# Altium schematic sheet iDProx.SchDoc
size A3
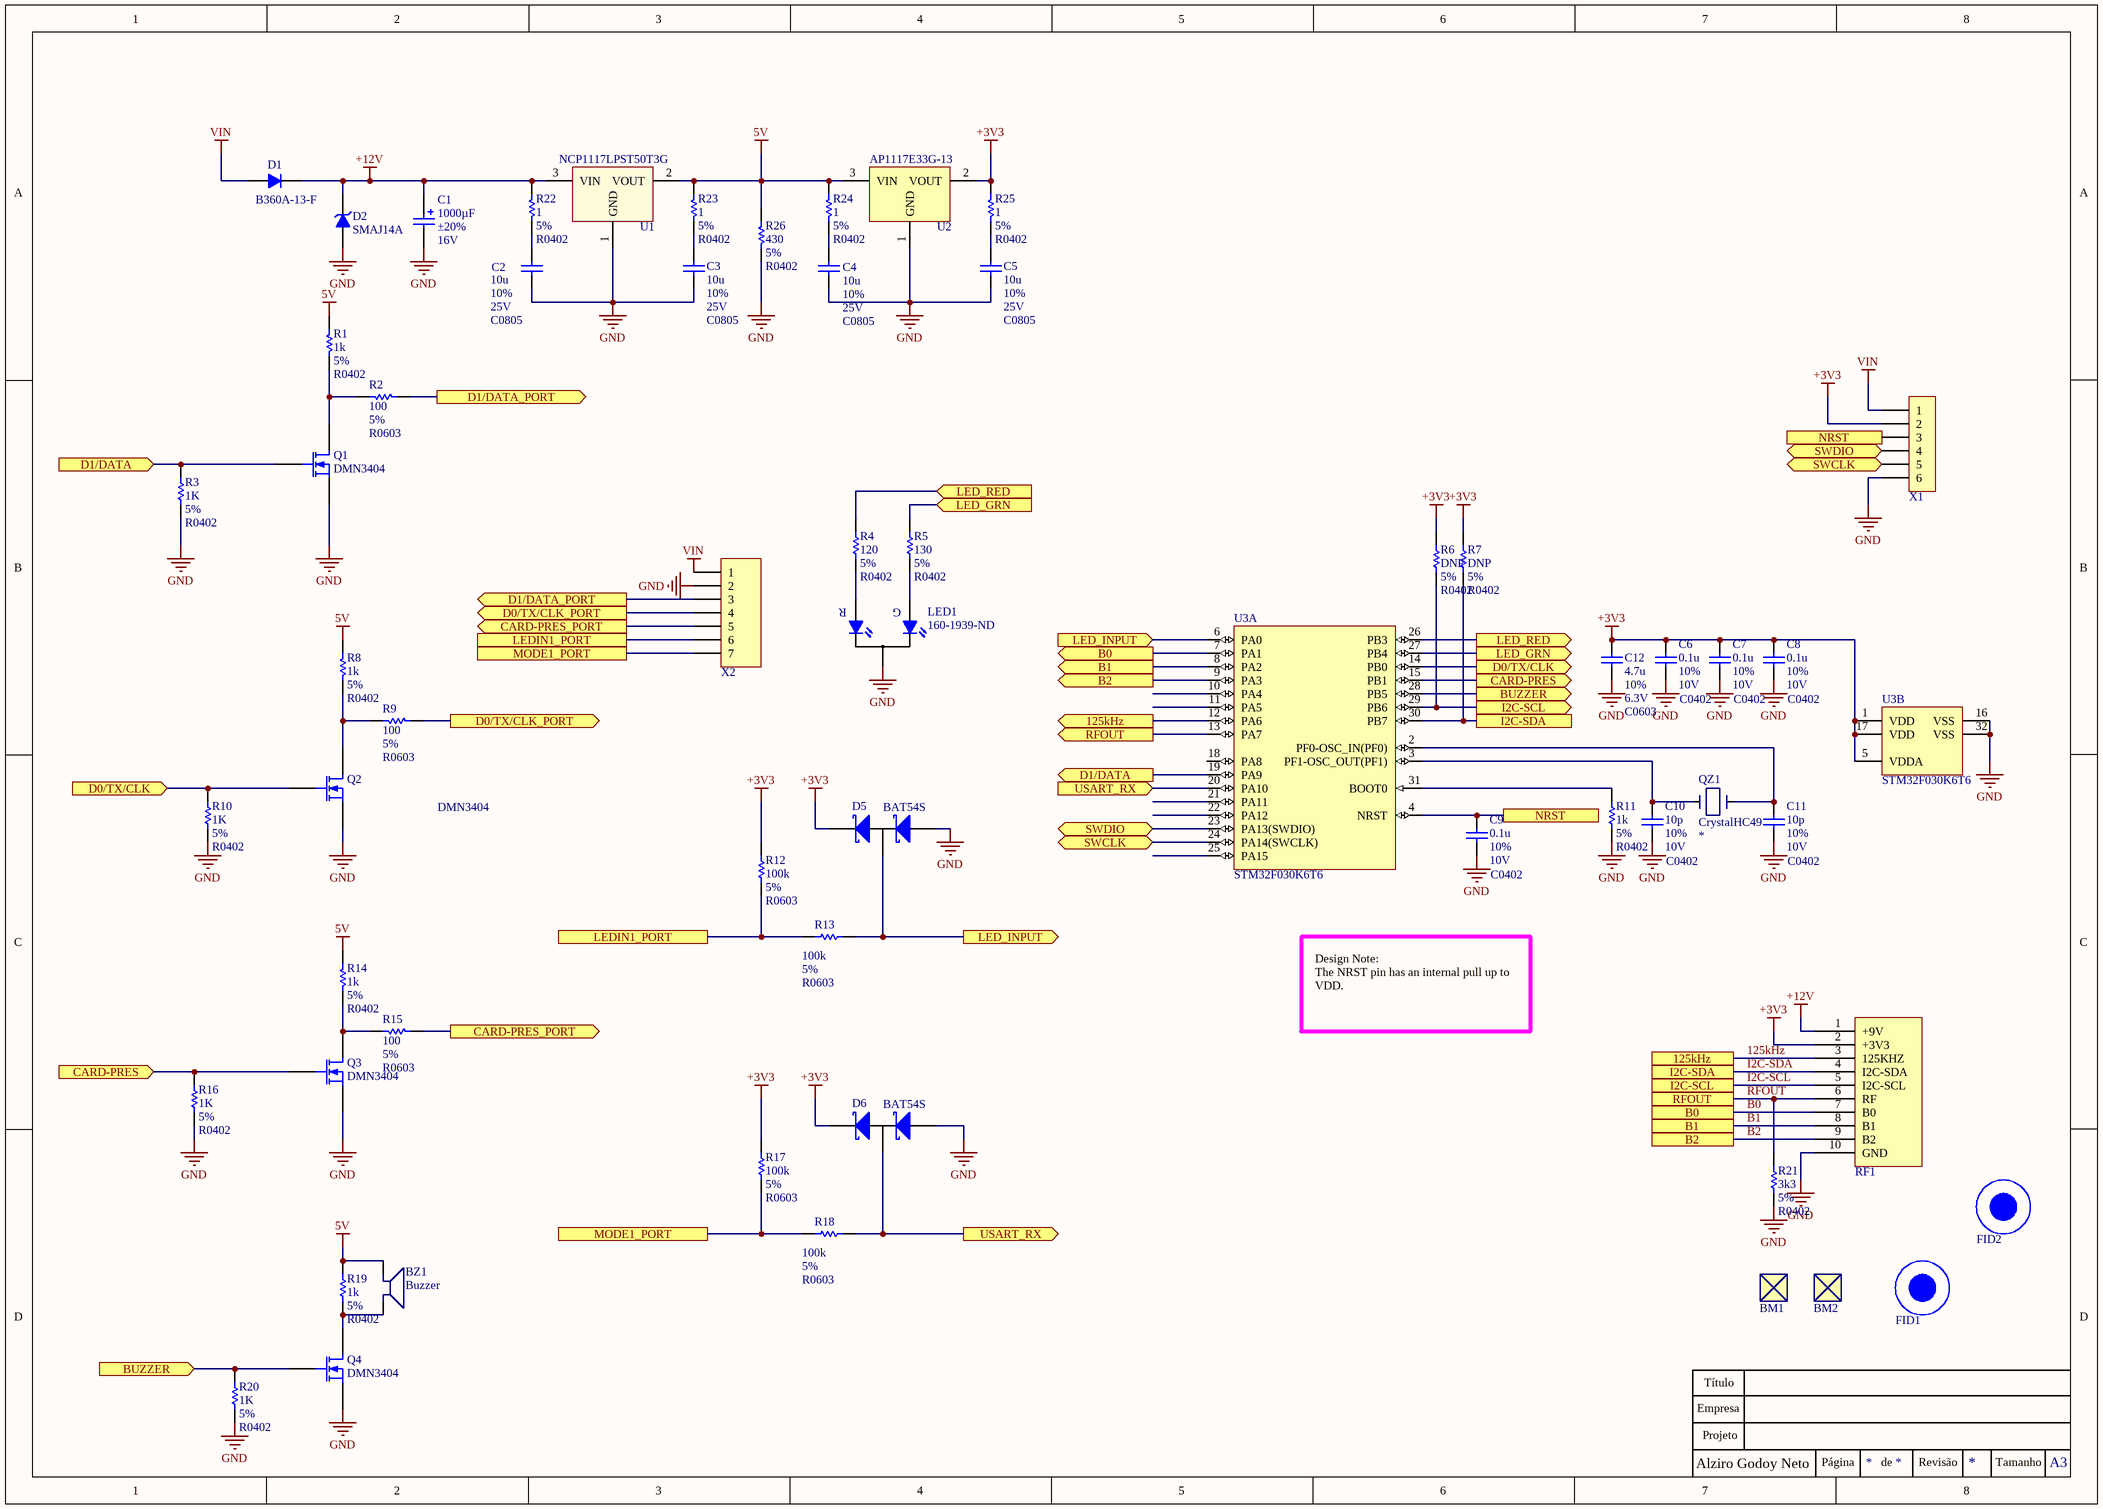
[diagram p0: iDProx.SchDoc]

## Parts
BM1  BADMARK  [BADMARK]  (value not drawn)
BM2  BADMARK  [BADMARK]  (value not drawn)
BZ1  Buzzer  [Buzzer]
C1  Capacitance: 1000µF  Tolerance: ±20%  Voltage Rating: 16V  [ESK108M016AH2AA]  (hidden comment: ESK108M016AH2AA)
C2  value 10u  Tolerance: 10%  MAX VDC: 25V  [C0805]  (hidden comment: Cap0805)
C3  value 10u  Tolerance: 10%  MAX VDC: 25V  [C0805]  (hidden comment: Cap0805)
C4  value 10u  Tolerance: 10%  MAX VDC: 25V  [C0805]  (hidden comment: Cap0805)
C5  value 10u  Tolerance: 10%  MAX VDC: 25V  [C0805]  (hidden comment: Cap0805)
C6  value 0.1u  Tolerance: 10%  MAX VDC: 10V  [C0402]  (hidden comment: Cap0402)
C7  value 0.1u  Tolerance: 10%  MAX VDC: 10V  [C0402]  (hidden comment: Cap0402)
C8  value 0.1u  Tolerance: 10%  MAX VDC: 10V  [C0402]  (hidden comment: Cap0402)
C9  value 0.1u  Tolerance: 10%  MAX VDC: 10V  [C0402]  (hidden comment: Cap0402)
C10  value 10p  Tolerance: 10%  MAX VDC: 10V  [C0402]  (hidden comment: Cap0402)
C11  value 10p  Tolerance: 10%  MAX VDC: 10V  [C0402]  (hidden comment: Cap0402)
C12  value 4.7u  Tolerance: 10%  MAX VDC: 6.3V  [C0603]  (hidden comment: Cap0603)
D1  B360A-13-F  [SMA]
D2  SMAJ14A  [SMA]
D5  BAT54S  [SOT23-3]
D6  BAT54S  [SOT23-3]
FID1  FIDUCIAL  [FIDUCIAL-1p5X3]  (value not drawn)
FID2  FIDUCIAL  [FIDUCIAL-1p5X3]  (value not drawn)
LED1  Supplier Part Number 1: 160-1939-ND  [LTL1BEKVJNN]  (hidden comment: LTL1BEKVJNN)
Q1  DMN3404  [SOT23-3]
Q2  DMN3404  [SOT23-3]
Q3  DMN3404  [SOT23-3]
Q4  DMN3404  [SOT23-3]
QZ1  CrystalHC49  [HC49]
R1  value 1k  Tolerance: 5%  [R0402]  (hidden comment: Res0402)
R2  value 100  Tolerance: 5%  [R0603]  (hidden comment: Res0603)
R3  value 1K  Tolerance: 5%  [R0402]  (hidden comment: Res0402)
R4  value 120  Tolerance: 5%  [R0402]  (hidden comment: Res0402)
R5  value 130  Tolerance: 5%  [R0402]  (hidden comment: Res0402)
R6  value DNP  Tolerance: 5%  [R0402]  (hidden comment: Res0402)
R7  value DNP  Tolerance: 5%  [R0402]  (hidden comment: Res0402)
R8  value 1k  Tolerance: 5%  [R0402]  (hidden comment: Res0402)
R9  value 100  Tolerance: 5%  [R0603]  (hidden comment: Res0603)
R10  value 1K  Tolerance: 5%  [R0402]  (hidden comment: Res0402)
R11  value 1k  Tolerance: 5%  [R0402]  (hidden comment: Res0402)
R12  value 100k  Tolerance: 5%  [R0603]  (hidden comment: Res0603)
R13  value 100k  Tolerance: 5%  [R0603]  (hidden comment: Res0603)
R14  value 1k  Tolerance: 5%  [R0402]  (hidden comment: Res0402)
R15  value 100  Tolerance: 5%  [R0603]  (hidden comment: Res0603)
R16  value 1K  Tolerance: 5%  [R0402]  (hidden comment: Res0402)
R17  value 100k  Tolerance: 5%  [R0603]  (hidden comment: Res0603)
R18  value 100k  Tolerance: 5%  [R0603]  (hidden comment: Res0603)
R19  value 1k  Tolerance: 5%  [R0402]  (hidden comment: Res0402)
R20  value 1K  Tolerance: 5%  [R0402]  (hidden comment: Res0402)
R21  value 3k3  Tolerance: 5%  [R0402]  (hidden comment: Res0402)
R22  value 1  Tolerance: 5%  [R0402]  (hidden comment: Res0402)
R23  value 1  Tolerance: 5%  [R0402]  (hidden comment: Res0402)
R24  value 1  Tolerance: 5%  [R0402]  (hidden comment: Res0402)
R25  value 1  Tolerance: 5%  [R0402]  (hidden comment: Res0402)
R26  value 430  Tolerance: 5%  [R0402]  (hidden comment: Res0402)
RF1  REPASK/REPMIF  [REPASK_REPMIF]  (value not drawn)
U1  NCP1117LPST50T3G  [SOT223]
U2  AP1117E33G-13  [SOT223]
U3  STM32F030K6T6  [STM-LQFP32_N]  (parts A,B of 2)
X1  Header 6  [1X06]  (value not drawn)
X2  JST7_HORIZ  [JST7_HORIZ]  (value not drawn)

## Ports
125kHz, 125kHz (out), B0, B0 (out), B1, B1 (out), B2, B2 (out), BUZZER (in), BUZZER (out), CARD-PRES (in), CARD-PRES (out), CARD-PRES_PORT (out), D0/TX/CLK (in), D0/TX/CLK (out), D0/TX/CLK_PORT (out), D1/DATA (in), D1/DATA (out), D1/DATA_PORT (out), I2C-SCL, I2C-SCL (out), I2C-SDA, LED_GRN (in), LED_GRN (out), LED_INPUT (in), LED_INPUT (out), LED_RED (in), LED_RED (out), LEDIN1_PORT, MODE1_PORT, NRST, RFOUT, RFOUT (out), SWCLK (bidir), SWDIO (bidir), USART_RX (in), USART_RX (out)

## Nets
5V: BZ1.1 R1.2 R8.2 R14.2 R19.2 R23.2 R24.2 R26.2 U1.2(VOUT) U2.3(VIN)
+3V3: C6.2 C7.2 C8.2 C12.2 D5.3(A1) D6.3(A1) R6.2 R7.2 R12.2 R17.2 R25.2 RF1.2(+3V3) U2.2(VOUT) U3.1(VDD) U3.5(VDDA) U3.17(VDD) X1.2
+12V: C1.1 D1.2(K) D2.2(K) R22.2 RF1.1(+9V) U1.3(VIN)
GND: C1.2 C2.2 C3.1 C4.2 C5.1 C6.1 C7.1 C8.1 C9.1 C10.1 C11.1 C12.1 D2.1(A) D5.2(A2) D6.2(A2) LED1.2(K) Q1.3(S) Q2.3(S) Q3.3(S) Q4.3(S) R3.1 R10.1 R11.1 R16.1 R20.1 R21.1 R26.1 RF1.10(GND) U1.1(GND) U2.1(GND) U3.16(VSS) U3.32(VSS) X1.6 X2.2
VIN: D1.1(A) X1.1 X2.1
125kHz: RF1.3(125KHZ) U3.12(PA6) ; port 125kHz
B0: RF1.7(B0) U3.7(PA1) ; port B0
B1: RF1.8(B1) U3.8(PA2) ; port B1
B2: RF1.9(B2) U3.9(PA3) ; port B2
BUZZER: Q4.2(G) R20.2 U3.28(PB5) ; port BUZZER
CARD-PRES: Q3.2(G) R16.2 U3.15(PB1) ; port CARD-PRES
CARD-PRES_PORT: R15.1 X2.5 ; port CARD-PRES_PORT
D0/TX/CLK: Q2.2(G) R10.2 U3.14(PB0) ; port D0/TX/CLK
D0/TX/CLK_PORT: R9.1 X2.4 ; port D0/TX/CLK_PORT
D1/DATA: Q1.2(G) R3.2 U3.19(PA9) ; port D1/DATA
D1/DATA_PORT: R2.1 X2.3 ; port D1/DATA_PORT
I2C-SCL: R6.1 RF1.5(I2C-SCL) U3.29(PB6) ; port I2C-SCL
I2C-SDA: R7.1 RF1.4(I2C-SDA) U3.30(PB7) ; port I2C-SDA
LED_GRN: R5.2 U3.27(PB4) ; port LED_GRN
LED_INPUT: D5.1(K) R13.2 U3.6(PA0) ; port LED_INPUT
LED_RED: R4.2 U3.26(PB3) ; port LED_RED
LEDIN1_PORT: R12.1 R13.1 X2.6 ; port LEDIN1_PORT
MODE1_PORT: R17.1 R18.1 X2.7 ; port MODE1_PORT
NRST: C9.2 U3.4(NRST) X1.3 ; port NRST
RFOUT: R21.2 RF1.6(RF) U3.13(PA7) ; port RFOUT
SWCLK: U3.24(PA14(SWCLK)) X1.5 ; port SWCLK
SWDIO: U3.23(PA13(SWDIO)) X1.4 ; port SWDIO
USART_RX: D6.1(K) R18.2 U3.20(PA10) ; port USART_RX
NetBZ1_2: BZ1.2 Q4.1(D) R19.1
NetC2_1: C2.1 R22.1
NetC3_2: C3.2 R23.1
NetC4_1: C4.1 R24.1
NetC5_2: C5.2 R25.1
NetC10_2: C10.2 QZ1.2(X2) U3.3(PF1-OSC_OUT(PF1))
NetC11_2: C11.2 QZ1.1(X1) U3.2(PF0-OSC_IN(PF0))
NetLED1_1: LED1.1(AR) R4.1
NetLED1_3: LED1.3(AG) R5.1
NetQ1_1: Q1.1(D) R1.1 R2.2
NetQ2_1: Q2.1(D) R8.1 R9.2
NetQ3_1: Q3.1(D) R14.1 R15.2
NetR11_2: R11.2 U3.31(BOOT0)

Not connected (* = marked no-connect by the designer): U3 10(PA4) 11(PA5) 18(PA8) 21(PA11) 22(PA12) 25(PA15)

## Notes on the sheet
- Design Note:
  The NRST pin has an internal pull up to VDD.
- Título
- Empresa
- Projeto
- Alziro Godoy Neto
- Página
- de
- Revisão
- Tamanho
- A3
- (in symbol LTL1BEKVJNN) R; G

## Library data of the parts
BM1 BM2 = BADMARK: Bad Mark Indicator
BZ1 = Buzzer: Standard PTH Buzzer
C1 = ESK108M016AH2AA: CAP ALUM 1000UF 20% 16V RADIAL; Manufacturer: Kemet; Lifetime @ Temp.: 2000 Hrs @ 85°C; Polarization: Polar; Ripple Current: 630mA @ 120Hz; Supplier 1: Digi-Key; Manufacturer Part Number: ESK108M016AH2AA; RoHS: RoHS Compliant; Category: Capacitors; Stock 1: 2866; Pricing 1: 1=0.43, 10=0.298, 50=0.2086, 100=0.1788, 250=0.149, 500=0.1341, 1000=0.11324, 2500=0.10728, 5000=0.10132 (USD); Packaging: Bulk; ESR (Equivalent Series Resistance): -; Operating Temperature: -40°C ~ 85°C; Applications: General Purpose; Impedance: -; Lead Spacing: 0.197" (5.00mm); Size / Dimension: 0.394" Dia (10.00mm); Height - Seated (Max): 0.669" (17.00mm); Surface Mount Land Size: -; Mounting Type: Through Hole; Package / Case: Radial, Can; ComponentLink1URL: http://capacitoredge.kemet.com/capedge2/DataSheet?pn=ESK108M016AH2AA; ComponentLink1Description: http://capacitoredge.kemet.com/capedge2/DataSheet?pn=ESK108M016AH2AA; Supplier Part Number 1: 399-6106-ND
C2-C5 = Cap0805: Capacitor
C6-C11 = Cap0402: Capacitor
C12 = Cap0603: Capacitor
D1 = B360A: B360A Diode; Manufacturer: Diodes Incorporated; Diode Type: Schottky; Voltage - DC Reverse (Vr) (Max): 60V; Current - Average Rectified (Io): 3A; Voltage - Forward (Vf) (Max) @ If: 700mV @ 3A; Speed: Fast Recovery =< 500ns, > 200mA (Io); Current - Reverse Leakage @ Vr: 500µA @ 60V; Capacitance @ Vr, F: 200pF @ 4V, 1MHz; Supplier 1: Digi-Key; Supplier Part Number 1: B360A-FDICT-ND; Manufacturer Part Number: B360A-13-F; RoHS: RoHS Compliant; Category: Discrete Semiconductor Products; Stock 1: 132804; Pricing 1: 1=0.5, 10=0.394, 25=0.3324, 100=0.2708, 250=0.22424, 500=0.18526, 1000=0.13875, 2500=0.1275 (USD); Packaging: Cut Tape (CT); Reverse Recovery Time (trr): -; Mounting Type: Surface Mount; Package / Case: DO-214AC, SMA; Supplier Device Package: SMA; Operating Temperature - Junction: -55°C ~ 150°C; ComponentLink1URL: http://www.diodes.com/_files/datasheets/ds30891.pdf; ComponentLink1Description: http://www.diodes.com/_files/datasheets/ds30891.pdf
D2 = SMAJ14A: TVS DIODE 14VWM 23.2VC SMA; Manufacturer: Littelfuse Inc.; Type: Zener; Unidirectional Channels: 1; Voltage - Reverse Standoff (Typ): 14V; Voltage - Breakdown (Min): 15.6V; Voltage - Clamping (Max) @ Ipp: 23.2V; Current - Peak Pulse (10/1000µs): 17.2A; Power - Peak Pulse: 400W; Power Line Protection: No; Supplier 1: Digi-Key; Manufacturer Part Number: SMAJ14A; RoHS: RoHS Compliant; Category: Circuit Protection; Stock 1: 42648; Pricing 1: 1=0.43, 10=0.36, 25=0.3156, 100=0.2701, 250=0.23424, 500=0.1984, 1000=0.15295, 2500=0.13984 (USD); Packaging: Cut Tape (CT); Bidirectional Channels: -; Applications: General Purpose; Capacitance @ Frequency: -; Operating Temperature: -55°C ~ 150°C (TJ); Mounting Type: Surface Mount; Package / Case: DO-214AC, SMA; Supplier Device Package: DO-214AC (SMA); ComponentLink1URL: http://www.littelfuse.com/~/media/electronics/datasheets/tvs_diodes/littelfuse_tvs_diode_smaj_datasheet.pdf.pdf; ComponentLink1Description: http://www.littelfuse.com/~/media/electronics/datasheets/tvs_diodes/littelfuse_tvs_diode_smaj_datasheet.pdf.pdf; Supplier Part Number 1: SMAJ14ALFCT-ND
D5 D6 = BAT54S: DIODE ARRAY SCHOTTKY 30V SOT23
FID1 FID2 = FIDUCIAL: Standard fiducial for Control iD boards
LED1 = LTL1BEKVJNN: LED GRN/RED DIFF 3MM ROUND T/H; Manufacturer: Lite-On Inc.; Color: Green, Red; Lens Color: White; Lens Transparency: Diffused; Millicandela Rating: 110mcd Green, 110mcd Red; Lens Style/Size: Round with Domed Top, 3.00mm; Voltage - Forward (Vf) (Typ): 2.1V Green, 2V Red; Current - Test: 20mA Green, 20mA Red; Viewing Angle: 45°; Wavelength - Dominant: 572nm Green, 631nm Red; Wavelength - Peak: 575nm Green, 639nm Red; Supplier 1: Digi-Key; Manufacturer Part Number: LTL1BEKVJNN; RoHS: RoHS Compliant; Category: Optoelectronics; Stock 1: 19364; Pricing 1: 1=0.47, 10=0.332, 100=0.2216, 250=0.18004, 500=0.13296, 1000=0.1108, 2500=0.09972, 5000=0.09418, 10000=0.08587 (USD); Packaging: Bulk; Mounting Type: Through Hole; Features: -; Package / Case: Radial - 3 Leads; Supplier Device Package: -; Size / Dimension: -; Height (Max): 5.15mm; ComponentLink1URL: http://optoelectronics.liteon.com/upload/download/DS20-2001-645/S_110_LTL1BEKVJNN.pdf; ComponentLink1Description: http://optoelectronics.liteon.com/upload/download/DS20-2001-645/S_110_LTL1BEKVJNN.pdf
Q1-Q4 = DMN3404: DMN3404 N-Channel MOSFET; Supplier 1: Digi-Key; Supplier Part Number 1: DMN3404LDICT-ND
R1 R3-R8 R10 R11 R14 R16 R19-R26 = Res0402: Resistor
R2 R9 R12 R13 R15 R17 R18 = Res0603: Resistor
RF1 = REPASK/REPMIF: Control iD RF Module
U1 = NCP1117LPST50T3G: IC REG LDO 5V 1A SOT223; Manufacturer: ON Semiconductor; Regulator Topology: Positive Fixed; Voltage - Dropout (Typical): 1.3V @ 1A; Number of Regulators: 1; Voltage - Input: Up to 18V; Current - Limit (Min): 1.1A; Supplier 1: Digi-Key; Manufacturer Part Number: NCP1117LPST50T3G; RoHS: RoHS Compliant; Category: Integrated Circuits (ICs); Stock 1: 6004; Pricing 1: 1=0.45, 10=0.362, 100=0.2468, 500=0.18476, 1000=0.13838 (USD); Packaging: Cut Tape (CT); Voltage - Output: 5V; Current - Output: 1A; Operating Temperature: 0°C ~ 125°C; Mounting Type: Surface Mount; Package / Case: TO-261-4, TO-261AA; Supplier Device Package: SOT-223; ComponentLink1URL: http://www.onsemi.com/pub_link/Collateral/NCP1117LP-D.PDF; ComponentLink1Description: http://www.onsemi.com/pub_link/Collateral/NCP1117LP-D.PDF; Supplier Part Number 1: NCP1117LPST50T3GOSCT-ND
U3 = STM32F030K6T6: ARM Cortex-M0 32-bit MCU, 32 KB Flash, 4 KB Internal RAM, 26 I/Os, 32-pin LQFP, -40 to 85 degC, Tray; FLASH Size (Prog) (kB): 32; I/Os (High Current): 26; Internal RAM Size (kB): 4; Operating Frequency(F) (Processor speed) (MHz): 48; Supply Voltage(Vcc) min (V): 2.4; DatasheetVersion: Rev. 1; PackageVersion: Rev. 1, 07/2013; PackageReference: LQFP32; PackageDescription: 32-Pin Low Profile Quad Flat Package, 7 x 7 mm Body, 0.8 mm Pitch; Supplier 1: Digi-Key; Supplier Part Number 1: 497-14046-ND; Supplier 2: Newark; Supplier Part Number 2: 19X6194; Supplier 3: Mouser; Supplier Part Number 3: 511-STM32F030K6T6; Core: ARM Cortex-M0; Packing: Tray; Mounting Technology: Surface Mount; PartNumber: STM32F030K6T6; ComponentLink1Description: Manufacturer URL; ComponentLink1URL: http://www.st.com/web/en/home.html; ComponentLink2Description: Datasheet; ComponentLink2URL: http://www.st.com/st-web-ui/static/active/en/resource/technical/document/datasheet/DM00088500.pdf; ComponentLink3Description: Package Specification; ComponentLink3URL: http://www.st.com/st-web-ui/static/active/en/resource/technical/document/datasheet/DM00088500.pdf
X1 = Header 6: Header, 6-Pin, Single row, 0.1"
QZ1 = CrystalHC49: Value: *